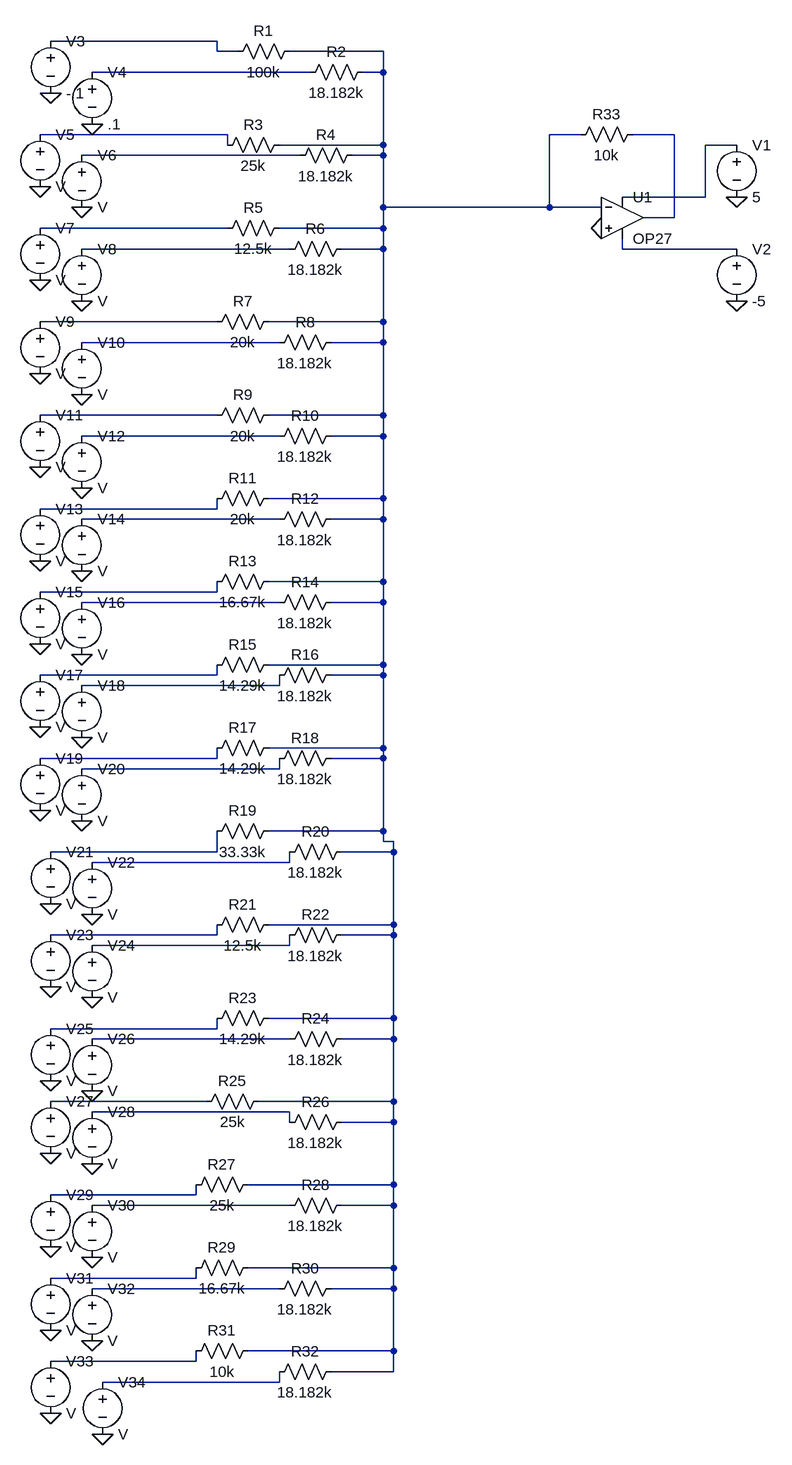
[diagram p0: schematic pattern_new_algo[Conflict].asc]
pattern_new_algo[Conflict].asc, the LTspice schematic file:
Version 4
SHEET 1 880 1844
WIRE -960 -320 -1216 -320
WIRE -960 -304 -960 -320
WIRE -928 -304 -960 -304
WIRE -704 -304 -848 -304
WIRE -816 -272 -1152 -272
WIRE -704 -272 -704 -304
WIRE -704 -272 -736 -272
WIRE -944 -176 -1232 -176
WIRE -400 -176 -448 -176
WIRE -256 -176 -320 -176
WIRE -944 -160 -944 -176
WIRE -704 -160 -704 -272
WIRE -704 -160 -864 -160
WIRE -160 -160 -208 -160
WIRE -832 -144 -1168 -144
WIRE -704 -144 -704 -160
WIRE -704 -144 -752 -144
WIRE -208 -80 -208 -160
WIRE -208 -80 -336 -80
WIRE -704 -64 -704 -144
WIRE -448 -64 -448 -176
WIRE -448 -64 -704 -64
WIRE -368 -64 -448 -64
WIRE -256 -48 -256 -176
WIRE -256 -48 -304 -48
WIRE -944 -32 -1232 -32
WIRE -704 -32 -704 -64
WIRE -704 -32 -864 -32
WIRE -848 0 -1168 0
WIRE -704 0 -704 -32
WIRE -704 0 -768 0
WIRE -336 0 -336 -16
WIRE -160 0 -336 0
WIRE -960 112 -1232 112
WIRE -704 112 -704 0
WIRE -704 112 -880 112
WIRE -864 144 -1168 144
WIRE -704 144 -704 112
WIRE -704 144 -784 144
WIRE -960 256 -1232 256
WIRE -704 256 -704 144
WIRE -704 256 -880 256
WIRE -864 288 -1168 288
WIRE -704 288 -704 256
WIRE -704 288 -784 288
WIRE -704 384 -704 288
WIRE -704 384 -880 384
WIRE -960 400 -960 384
WIRE -960 400 -1232 400
WIRE -864 416 -1168 416
WIRE -704 416 -704 384
WIRE -704 416 -784 416
WIRE -704 512 -704 416
WIRE -704 512 -880 512
WIRE -960 528 -960 512
WIRE -960 528 -1232 528
WIRE -864 544 -1168 544
WIRE -704 544 -704 512
WIRE -704 544 -784 544
WIRE -704 640 -704 544
WIRE -704 640 -880 640
WIRE -960 656 -960 640
WIRE -960 656 -1232 656
WIRE -704 656 -704 640
WIRE -704 656 -784 656
WIRE -864 672 -864 656
WIRE -864 672 -1168 672
WIRE -704 768 -704 656
WIRE -704 768 -880 768
WIRE -960 784 -960 768
WIRE -960 784 -1232 784
WIRE -704 784 -704 768
WIRE -704 784 -784 784
WIRE -864 800 -864 784
WIRE -864 800 -1168 800
WIRE -704 896 -704 784
WIRE -704 896 -880 896
WIRE -704 912 -704 896
WIRE -688 912 -704 912
WIRE -960 928 -960 896
WIRE -960 928 -1216 928
WIRE -688 928 -688 912
WIRE -688 928 -768 928
WIRE -848 944 -848 928
WIRE -848 944 -1152 944
WIRE -688 1040 -688 928
WIRE -688 1040 -880 1040
WIRE -960 1056 -960 1040
WIRE -960 1056 -1216 1056
WIRE -688 1056 -688 1040
WIRE -688 1056 -768 1056
WIRE -848 1072 -848 1056
WIRE -848 1072 -1152 1072
WIRE -688 1184 -688 1056
WIRE -688 1184 -880 1184
WIRE -960 1200 -960 1184
WIRE -960 1200 -1216 1200
WIRE -848 1216 -1152 1216
WIRE -688 1216 -688 1184
WIRE -688 1216 -768 1216
WIRE -976 1312 -1216 1312
WIRE -688 1312 -688 1216
WIRE -688 1312 -896 1312
WIRE -848 1328 -1152 1328
WIRE -848 1344 -848 1328
WIRE -688 1344 -688 1312
WIRE -688 1344 -768 1344
WIRE -688 1440 -688 1344
WIRE -688 1440 -912 1440
WIRE -992 1456 -992 1440
WIRE -992 1456 -1216 1456
WIRE -848 1472 -1152 1472
WIRE -688 1472 -688 1440
WIRE -688 1472 -768 1472
WIRE -688 1568 -688 1472
WIRE -688 1568 -912 1568
WIRE -992 1584 -992 1568
WIRE -992 1584 -1216 1584
WIRE -864 1600 -1152 1600
WIRE -688 1600 -688 1568
WIRE -688 1600 -784 1600
WIRE -688 1696 -688 1600
WIRE -688 1696 -912 1696
WIRE -992 1712 -992 1696
WIRE -992 1712 -1216 1712
WIRE -688 1728 -688 1696
WIRE -688 1728 -784 1728
WIRE -864 1744 -864 1728
WIRE -864 1744 -1136 1744
FLAG -368 -32 0
FLAG -160 80 0
FLAG -160 -80 0
FLAG -1216 -240 0
FLAG -1152 -192 0
FLAG -1232 -96 0
FLAG -1168 -64 0
FLAG -1232 48 0
FLAG -1168 80 0
FLAG -1232 192 0
FLAG -1168 224 0
FLAG -1232 336 0
FLAG -1168 368 0
FLAG -1232 480 0
FLAG -1168 496 0
FLAG -1232 608 0
FLAG -1168 624 0
FLAG -1232 736 0
FLAG -1168 752 0
FLAG -1232 864 0
FLAG -1168 880 0
FLAG -1216 1008 0
FLAG -1152 1024 0
FLAG -1216 1136 0
FLAG -1152 1152 0
FLAG -1216 1280 0
FLAG -1152 1296 0
FLAG -1216 1392 0
FLAG -1152 1408 0
FLAG -1216 1536 0
FLAG -1152 1552 0
FLAG -1216 1664 0
FLAG -1152 1680 0
FLAG -1216 1792 0
FLAG -1136 1824 0
SYMBOL Opamps\\OP27 -336 -112 R0
SYMATTR InstName U1
SYMBOL voltage -160 -176 R0
WINDOW 123 0 0 Left 2
WINDOW 39 0 0 Left 2
SYMATTR InstName V1
SYMATTR Value 5
SYMBOL voltage -160 -16 R0
WINDOW 123 0 0 Left 2
WINDOW 39 0 0 Left 2
SYMATTR InstName V2
SYMATTR Value -5
SYMBOL voltage -1216 -336 R0
WINDOW 123 0 0 Left 2
WINDOW 39 0 0 Left 2
SYMATTR InstName V3
SYMATTR Value -.1
SYMBOL voltage -1152 -288 R0
WINDOW 123 0 0 Left 2
WINDOW 39 0 0 Left 2
SYMATTR InstName V4
SYMATTR Value .1
SYMBOL voltage -1232 -192 R0
SYMATTR InstName V5
SYMBOL voltage -1168 -160 R0
SYMATTR InstName V6
SYMBOL voltage -1232 -48 R0
SYMATTR InstName V7
SYMBOL voltage -1168 -16 R0
SYMATTR InstName V8
SYMBOL voltage -1232 96 R0
SYMATTR InstName V9
SYMBOL voltage -1168 128 R0
SYMATTR InstName V10
SYMBOL voltage -1232 240 R0
SYMATTR InstName V11
SYMBOL voltage -1168 272 R0
SYMATTR InstName V12
SYMBOL voltage -1232 384 R0
SYMATTR InstName V13
SYMBOL voltage -1168 400 R0
SYMATTR InstName V14
SYMBOL voltage -1232 512 R0
SYMATTR InstName V15
SYMBOL voltage -1168 528 R0
SYMATTR InstName V16
SYMBOL voltage -1232 640 R0
SYMATTR InstName V17
SYMBOL voltage -1168 656 R0
SYMATTR InstName V18
SYMBOL voltage -1232 768 R0
SYMATTR InstName V19
SYMBOL voltage -1168 784 R0
SYMATTR InstName V20
SYMBOL voltage -1216 912 R0
SYMATTR InstName V21
SYMBOL voltage -1152 928 R0
SYMATTR InstName V22
SYMBOL voltage -1216 1040 R0
SYMATTR InstName V23
SYMBOL voltage -1152 1056 R0
SYMATTR InstName V24
SYMBOL voltage -1216 1184 R0
SYMATTR InstName V25
SYMBOL voltage -1152 1200 R0
SYMATTR InstName V26
SYMBOL voltage -1216 1296 R0
SYMATTR InstName V27
SYMBOL voltage -1152 1312 R0
SYMATTR InstName V28
SYMBOL voltage -1216 1440 R0
SYMATTR InstName V29
SYMBOL voltage -1152 1456 R0
SYMATTR InstName V30
SYMBOL voltage -1216 1568 R0
SYMATTR InstName V31
SYMBOL voltage -1152 1584 R0
SYMATTR InstName V32
SYMBOL voltage -1216 1696 R0
SYMATTR InstName V33
SYMBOL voltage -1136 1728 R0
SYMATTR InstName V34
SYMBOL res -832 -320 R90
WINDOW 0 0 56 VBottom 2
WINDOW 3 32 56 VTop 2
SYMATTR InstName R1
SYMATTR Value 100k
SYMBOL res -720 -288 R90
WINDOW 0 0 56 VBottom 2
WINDOW 3 32 56 VTop 2
SYMATTR InstName R2
SYMATTR Value 18.182k
SYMBOL res -848 -176 R90
WINDOW 0 0 56 VBottom 2
WINDOW 3 32 56 VTop 2
SYMATTR InstName R3
SYMATTR Value 25k
SYMBOL res -736 -160 R90
WINDOW 0 0 56 VBottom 2
WINDOW 3 32 56 VTop 2
SYMATTR InstName R4
SYMATTR Value 18.182k
SYMBOL res -848 -48 R90
WINDOW 0 0 56 VBottom 2
WINDOW 3 32 56 VTop 2
SYMATTR InstName R5
SYMATTR Value 12.5k
SYMBOL res -752 -16 R90
WINDOW 0 0 56 VBottom 2
WINDOW 3 32 56 VTop 2
SYMATTR InstName R6
SYMATTR Value 18.182k
SYMBOL res -864 96 R90
WINDOW 0 0 56 VBottom 2
WINDOW 3 32 56 VTop 2
SYMATTR InstName R7
SYMATTR Value 20k
SYMBOL res -768 128 R90
WINDOW 0 0 56 VBottom 2
WINDOW 3 32 56 VTop 2
SYMATTR InstName R8
SYMATTR Value 18.182k
SYMBOL res -864 240 R90
WINDOW 0 0 56 VBottom 2
WINDOW 3 32 56 VTop 2
SYMATTR InstName R9
SYMATTR Value 20k
SYMBOL res -768 272 R90
WINDOW 0 0 56 VBottom 2
WINDOW 3 32 56 VTop 2
SYMATTR InstName R10
SYMATTR Value 18.182k
SYMBOL res -864 368 R90
WINDOW 0 0 56 VBottom 2
WINDOW 3 32 56 VTop 2
SYMATTR InstName R11
SYMATTR Value 20k
SYMBOL res -768 400 R90
WINDOW 0 0 56 VBottom 2
WINDOW 3 32 56 VTop 2
SYMATTR InstName R12
SYMATTR Value 18.182k
SYMBOL res -864 496 R90
WINDOW 0 0 56 VBottom 2
WINDOW 3 32 56 VTop 2
SYMATTR InstName R13
SYMATTR Value 16.67k
SYMBOL res -768 528 R90
WINDOW 0 0 56 VBottom 2
WINDOW 3 32 56 VTop 2
SYMATTR InstName R14
SYMATTR Value 18.182k
SYMBOL res -864 624 R90
WINDOW 0 0 56 VBottom 2
WINDOW 3 32 56 VTop 2
SYMATTR InstName R15
SYMATTR Value 14.29k
SYMBOL res -768 640 R90
WINDOW 0 0 56 VBottom 2
WINDOW 3 32 56 VTop 2
SYMATTR InstName R16
SYMATTR Value 18.182k
SYMBOL res -864 752 R90
WINDOW 0 0 56 VBottom 2
WINDOW 3 32 56 VTop 2
SYMATTR InstName R17
SYMATTR Value 14.29k
SYMBOL res -768 768 R90
WINDOW 0 0 56 VBottom 2
WINDOW 3 32 56 VTop 2
SYMATTR InstName R18
SYMATTR Value 18.182k
SYMBOL res -864 880 R90
WINDOW 0 0 56 VBottom 2
WINDOW 3 32 56 VTop 2
SYMATTR InstName R19
SYMATTR Value 33.33k
SYMBOL res -752 912 R90
WINDOW 0 0 56 VBottom 2
WINDOW 3 32 56 VTop 2
SYMATTR InstName R20
SYMATTR Value 18.182k
SYMBOL res -864 1024 R90
WINDOW 0 0 56 VBottom 2
WINDOW 3 32 56 VTop 2
SYMATTR InstName R21
SYMATTR Value 12.5k
SYMBOL res -752 1040 R90
WINDOW 0 0 56 VBottom 2
WINDOW 3 32 56 VTop 2
SYMATTR InstName R22
SYMATTR Value 18.182k
SYMBOL res -864 1168 R90
WINDOW 0 0 56 VBottom 2
WINDOW 3 32 56 VTop 2
SYMATTR InstName R23
SYMATTR Value 14.29k
SYMBOL res -752 1200 R90
WINDOW 0 0 56 VBottom 2
WINDOW 3 32 56 VTop 2
SYMATTR InstName R24
SYMATTR Value 18.182k
SYMBOL res -880 1296 R90
WINDOW 0 0 56 VBottom 2
WINDOW 3 32 56 VTop 2
SYMATTR InstName R25
SYMATTR Value 25k
SYMBOL res -752 1328 R90
WINDOW 0 0 56 VBottom 2
WINDOW 3 32 56 VTop 2
SYMATTR InstName R26
SYMATTR Value 18.182k
SYMBOL res -896 1424 R90
WINDOW 0 0 56 VBottom 2
WINDOW 3 32 56 VTop 2
SYMATTR InstName R27
SYMATTR Value 25k
SYMBOL res -752 1456 R90
WINDOW 0 0 56 VBottom 2
WINDOW 3 32 56 VTop 2
SYMATTR InstName R28
SYMATTR Value 18.182k
SYMBOL res -896 1552 R90
WINDOW 0 0 56 VBottom 2
WINDOW 3 32 56 VTop 2
SYMATTR InstName R29
SYMATTR Value 16.67k
SYMBOL res -768 1584 R90
WINDOW 0 0 56 VBottom 2
WINDOW 3 32 56 VTop 2
SYMATTR InstName R30
SYMATTR Value 18.182k
SYMBOL res -896 1680 R90
WINDOW 0 0 56 VBottom 2
WINDOW 3 32 56 VTop 2
SYMATTR InstName R31
SYMATTR Value 10k
SYMBOL res -768 1712 R90
WINDOW 0 0 56 VBottom 2
WINDOW 3 32 56 VTop 2
SYMATTR InstName R32
SYMATTR Value 18.182k
SYMBOL res -304 -192 R90
WINDOW 0 0 56 VBottom 2
WINDOW 3 32 56 VTop 2
SYMATTR InstName R33
SYMATTR Value 10k

The netlist it stands for:
* pattern_new_algo[Conflict].asc
XU1 0 N002 N006 N010 N005 OP27  ; pins In+ In- V+ V- OUT
V1 N006 0 5
V2 N010 0 -5
V3 N001 0 -.1
V4 N003 0 .1
V5 N004 0 V
V6 N007 0 V
V7 N008 0 V
V8 N009 0 V
V9 N011 0 V
V10 N012 0 V
V11 N013 0 V
V12 N014 0 V
V13 N015 0 V
V14 N016 0 V
V15 N017 0 V
V16 N018 0 V
V17 N019 0 V
V18 N020 0 V
V19 N021 0 V
V20 N022 0 V
V21 N023 0 V
V22 N024 0 V
V23 N025 0 V
V24 N026 0 V
V25 N027 0 V
V26 N028 0 V
V27 N029 0 V
V28 N030 0 V
V29 N031 0 V
V30 N032 0 V
V31 N033 0 V
V32 N034 0 V
V33 N035 0 V
V34 N036 0 V
R1 N002 N001 100k
R2 N002 N003 18.182k
R3 N002 N004 25k
R4 N002 N007 18.182k
R5 N002 N008 12.5k
R6 N002 N009 18.182k
R7 N002 N011 20k
R8 N002 N012 18.182k
R9 N002 N013 20k
R10 N002 N014 18.182k
R11 N002 N015 20k
R12 N002 N016 18.182k
R13 N002 N017 16.67k
R14 N002 N018 18.182k
R15 N002 N019 14.29k
R16 N002 N020 18.182k
R17 N002 N021 14.29k
R18 N002 N022 18.182k
R19 N002 N023 33.33k
R20 N002 N024 18.182k
R21 N002 N025 12.5k
R22 N002 N026 18.182k
R23 N002 N027 14.29k
R24 N002 N028 18.182k
R25 N002 N029 25k
R26 N002 N030 18.182k
R27 N002 N031 25k
R28 N002 N032 18.182k
R29 N002 N033 16.67k
R30 N002 N034 18.182k
R31 N002 N035 10k
R32 N002 N036 18.182k
R33 N005 N002 10k
.lib ADI.lib
.backanno
.end